# Altium project ESP32_Gateway.PrjPcb
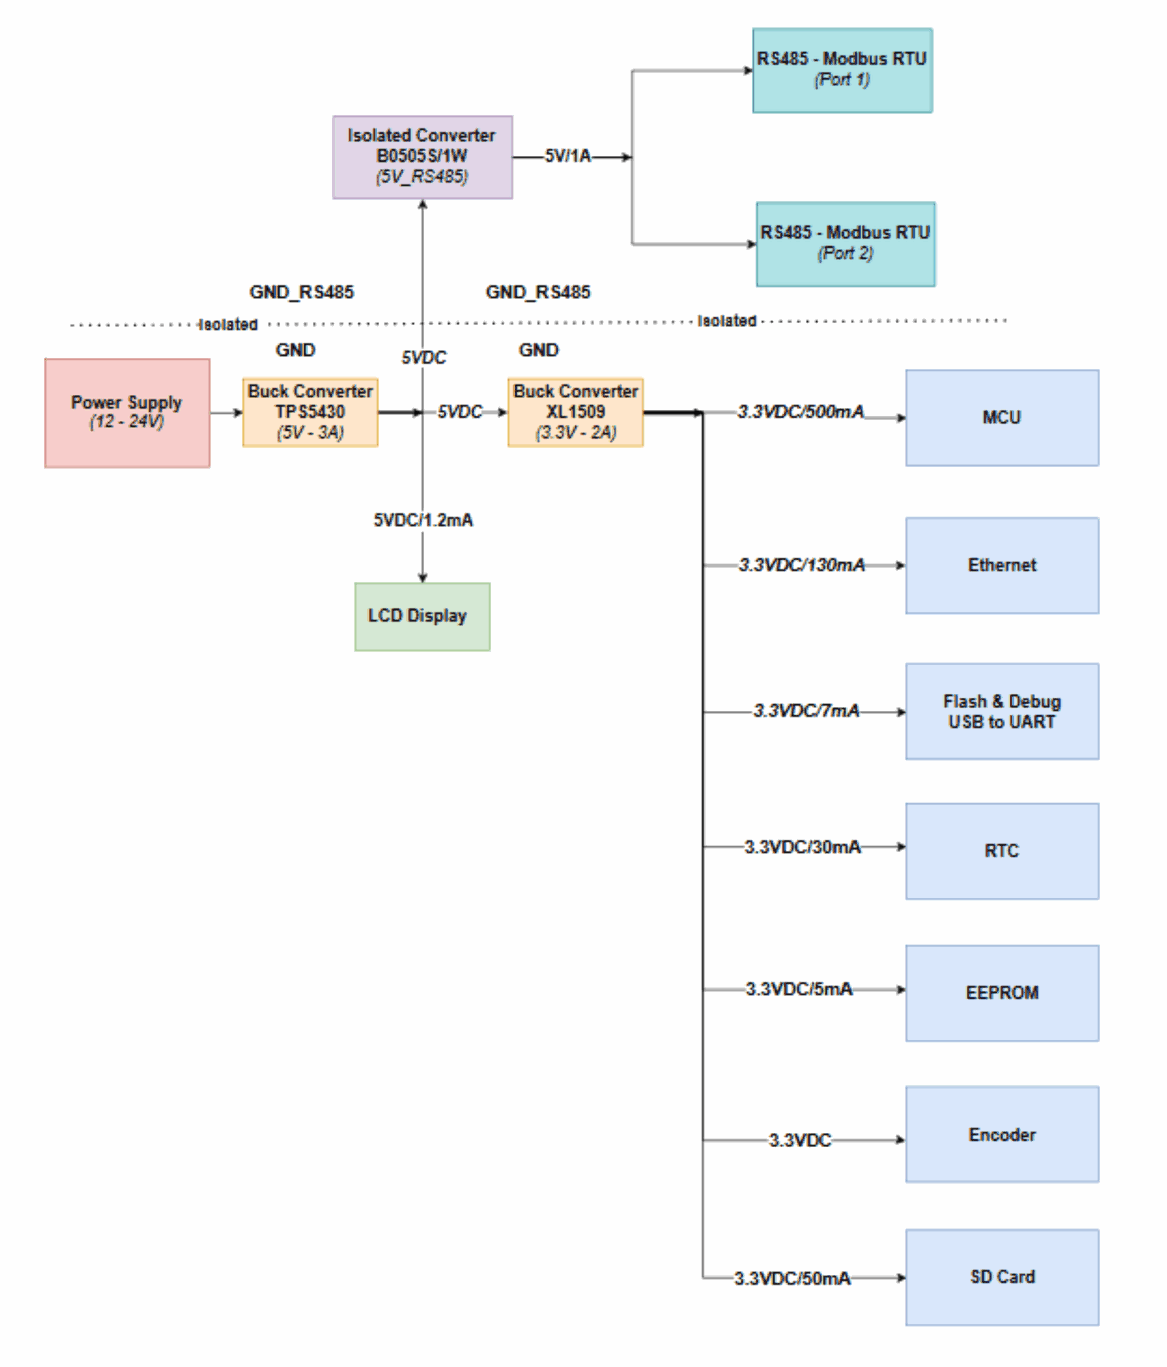
[diagram p0: Power_Tree.SchDoc]
7 sheets, 207 parts. Net scope: flat (ports and power ports of the same name join across sheets).
Board file: GATEWAY_PCB.PcbDoc
Sheets:
  Power_Tree.SchDoc
  Power_Supply.SchDoc
  Ethernet.SchDoc
  RS485_Port.SchDoc
  User_Interface.SchDoc
  RTC_and_EEPROM.SchDoc
  MCU.SchDoc

## Sheet Power_Tree.SchDoc
size A3; SheetNumber: 3; SheetTotal: 9

## Sheet Power_Supply.SchDoc
size A3; SheetNumber: 4; SheetTotal: 9
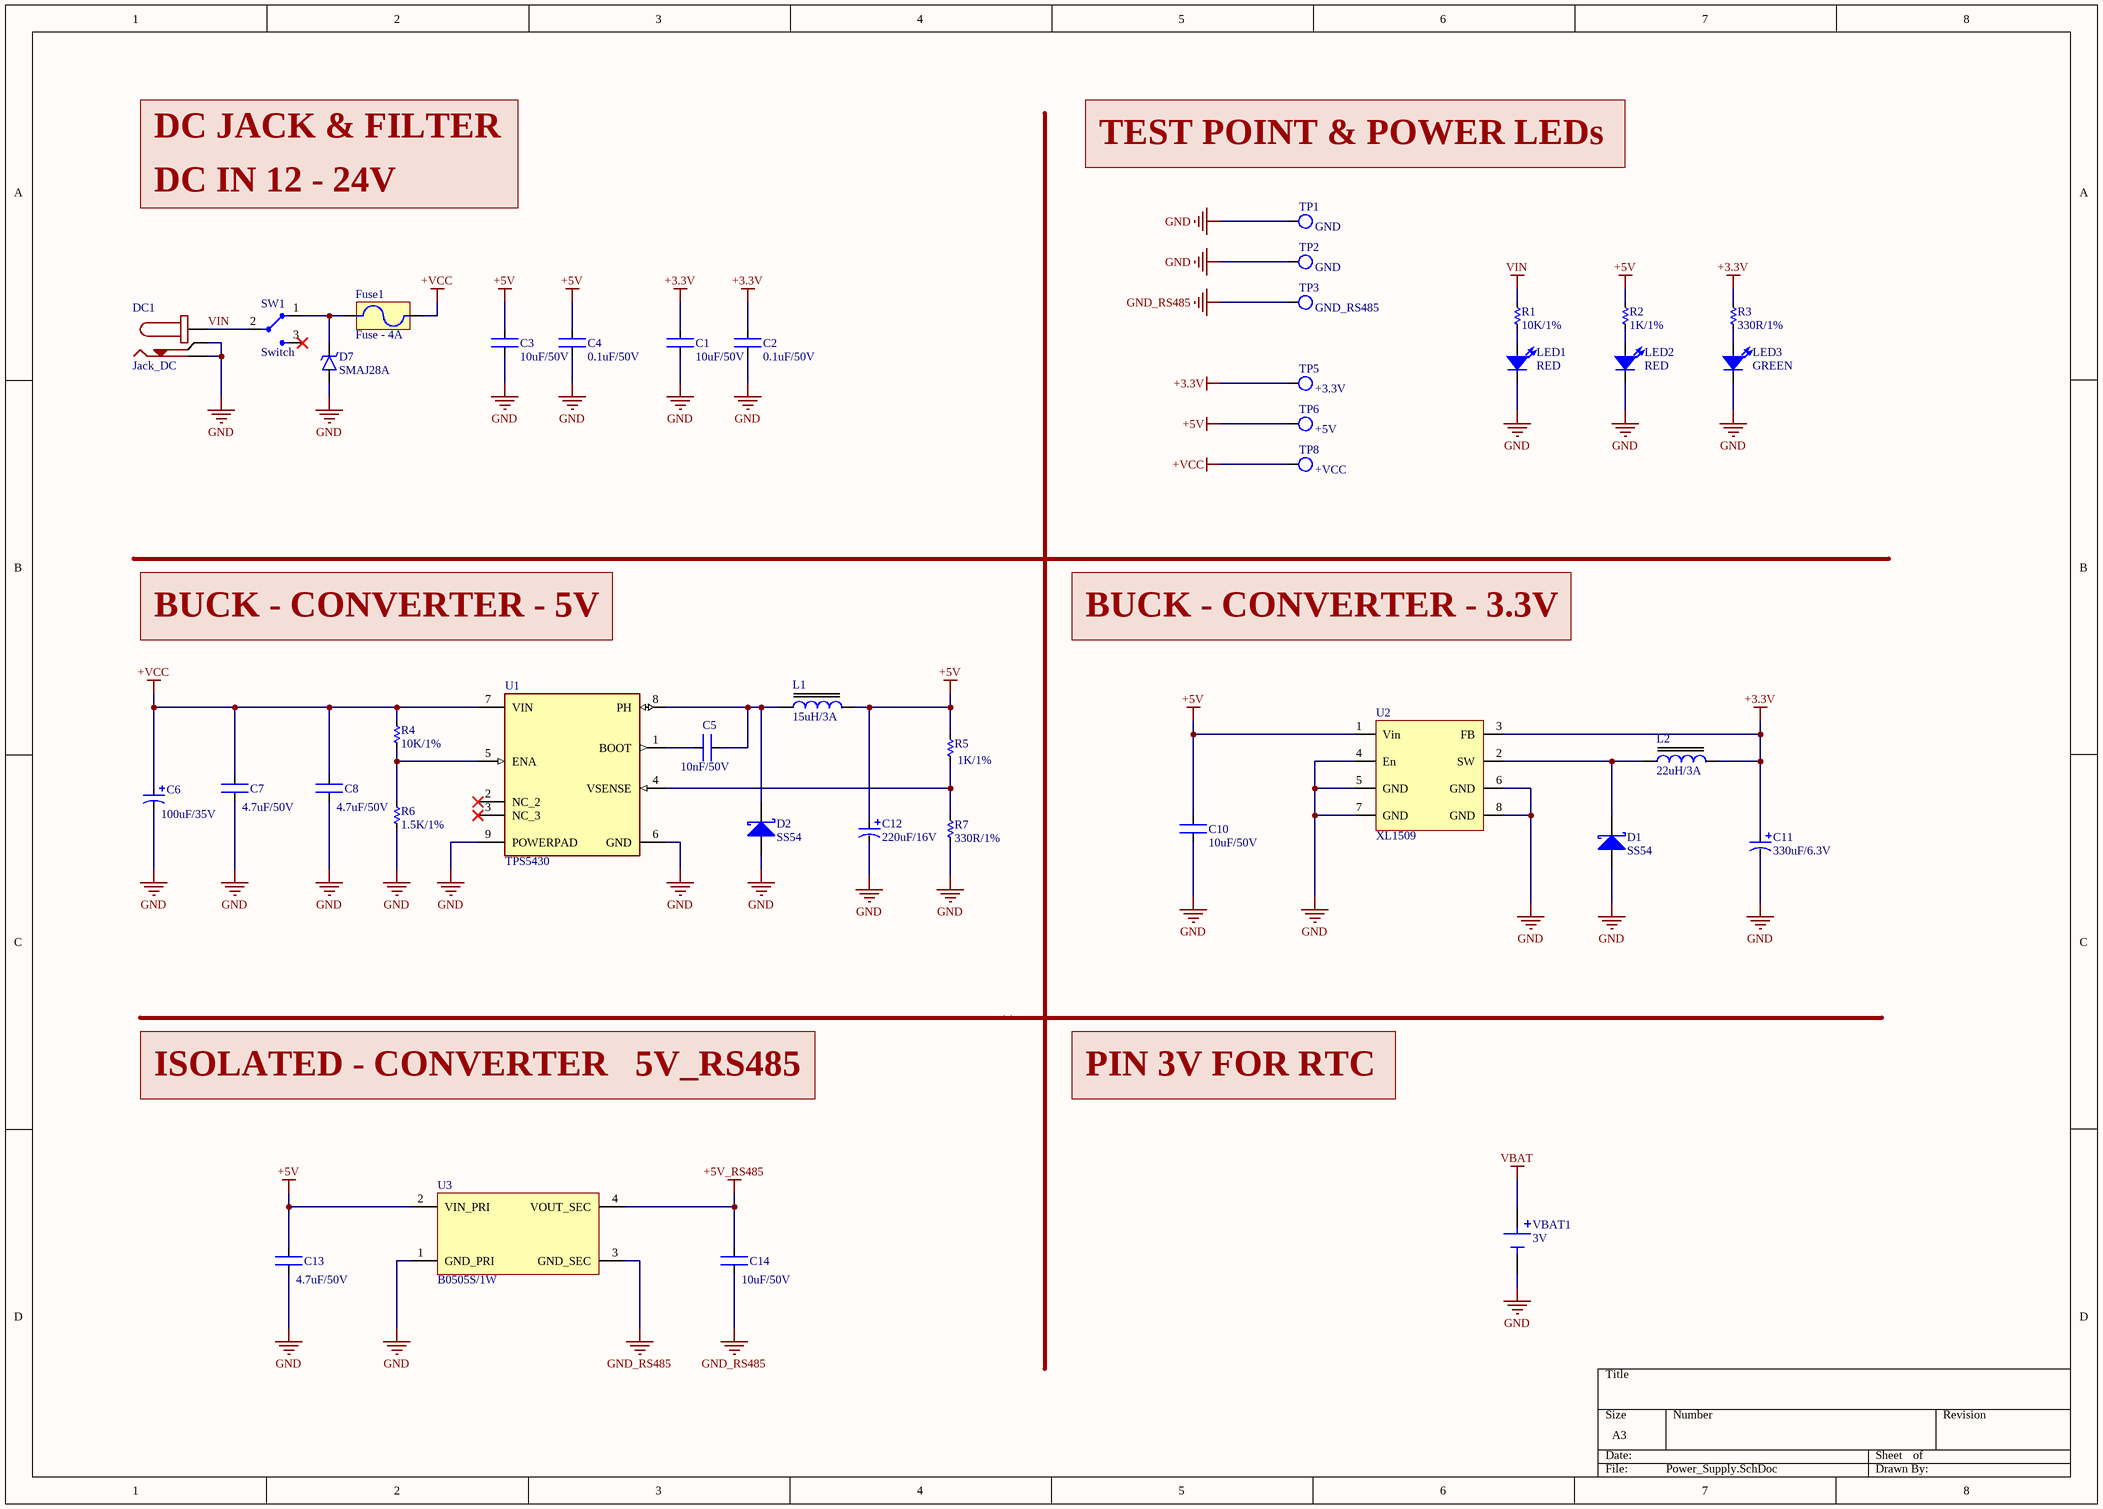
[diagram p1: Power_Supply.SchDoc]

### Parts
C1  10uF/50V  [CAP - 0603]
C2  0.1uF/50V  [CAP - 0603]
C3  10uF/50V  [CAP - 0603]
C4  0.1uF/50V  [CAP - 0603]
C5  10nF/50V  [CAP - 0603]
C6  100uF/35V  [Alu_Cap_6.3_7.7]
C7  4.7uF/50V  [CAP - 0603]
C8  4.7uF/50V  [CAP - 0603]
C10  10uF/50V  [CAP - 0603]
C11  330uF/6.3V  [Alu_Cap_6.3_7.7]
C12  220uF/16V  [Alu_Cap_6.3_7.7]
C13  4.7uF/50V  [CAP - 0603]
C14  10uF/50V  [CAP - 0603]
D1  SS54  [SS54]
D2  SS54  [SS54]
D7  SMAJ28A  [DO-214AC]
DC1  Jack_DC  [DC_5.5 x 2.1mm]
Fuse1  Fuse - 4A  [SMD-2]
L1  15uH/3A  [L_SMD_0630]
L2  22uH/3A  [L_SMD_0630]
LED1  RED  [RED_LED_0603]
LED2  RED  [RED_LED_0603]
LED3  GREEN  [GREEN_LED_0603]
R1  10K/1%  [RES - 0603]
R2  1K/1%  [RES - 0603]
R3  330R/1%  [RES - 0603]
R4  10K/1%  [RES - 0603]
R5  1K/1%  [RES - 0603]
R6  1.5K/1%  [RES - 0603]
R7  330R/1%  [RES - 0603]
SW1  Switch  [Dip_Switch_3_pins_0]
TP1  GND  [Test Point]
TP2  GND  [Test Point]
TP3  GND_RS485  [Test Point]
TP5  +3.3V  [Test Point]
TP6  +5V  [Test Point]
TP8  +VCC  [Test Point]
U1  TPS5430  [TPS5430]
U2  XL1509  [SOP_8]
U3  B0505S/1W  [B0505S/1W]
VBAT1  3V  [CR2032 - SMD]

### Nets
+3.3V: C1.1 C2.1 C11.1 L2.2 R3.1 TP5.1 U2.3(FB)
+5V: C3.1 C4.1 C10.1 C12.1 C13.1 L1.2 R2.1 R5.1 TP6.1 U2.1(Vin) U3.2(VIN_PRI)
+5V_RS485: C14.1 U3.4(VOUT_SEC)
+VCC: C6.1 C7.1 C8.1 Fuse1.2 R4.1 TP8.1 U1.7(VIN)
GND: C1.2 C2.2 C3.2 C4.2 C6.2 C7.2 C8.2 C10.2 C11.2 C12.2 C13.2 D1.1(A) D2.1(A) D7.A DC1.2(TN) DC1.3(T) LED1.2 LED2.2 LED3.2 R6.2 R7.2 TP1.1 TP2.1 U1.6(GND) U1.9(POWERPAD) U2.4(En) U2.5(GND) U2.6(GND) U2.7(GND) U2.8(GND) U3.1(GND_PRI) VBAT1.N(NEG)
GND_RS485: C14.2 TP3.1 U3.3(GND_SEC)
VBAT: VBAT1.P(POS)
VIN: DC1.1(S) R1.1 SW1.2
NetC5_1: C5.1 U1.1(BOOT)
NetC5_2: C5.2 D2.2(K) L1.1 U1.8(PH)
NetD1_2: D1.2(K) L2.1 U2.2(SW)
NetD7_C: D7.C Fuse1.1 SW1.1
NetLED1_1: LED1.1 R1.2
NetLED2_1: LED2.1 R2.2
NetLED3_1: LED3.1 R3.2
NetR4_2: R4.2 R6.1 U1.5(ENA)
NetR5_2: R5.2 R7.1 U1.4(VSENSE)

Not connected (* = marked no-connect by the designer): SW1 3(I/O2)*; U1 2(NC_2)* 3(NC_3)*

### Notes on the sheet
- DC JACK & FILTER
- TEST POINT & POWER LEDs
- DC IN 12 - 24V
- BUCK - CONVERTER - 5V
- BUCK - CONVERTER - 3.3V
- ISOLATED - CONVERTER   5V_RS485
- PIN 3V FOR RTC

### Library data of the parts
C1-C5 C7 C8 C10 C13 C14 = CAPACITOR: CAPACITOR SMD - KEMET
C6 C11 C12 = Alu_Capacitor
D1 D2 = SS54: DIODE SCHOTTKY 40V 5A SMA; Supplier 1: Newark; Supplier Part Number 1: 08X3002
D7 = SMAJ28A: 45.4V Clamp 8.8A Ipp Tvs diode surface mount
DC1 = Jack_DC: Jack DC IN (Hole)
Fuse1 = Fuse: Nano2 SMD FF submin fuse w/holder, 4A | Littelfuse 0154004.DR
L1 L2 = Inductor_1_SMD
LED1-LED3 = LED_SMD: LED SMD
R1-R7 = RESISTOR: Resistor SMD - YAGEO
SW1 = Switch: Switch 3 Pins
TP1-TP3 TP5 TP6 TP8 = TEST POINT: Supplier Part Number 1: 36-5014-ND; Supplier 1: Digikey
U1 = TPS5430: Buck DC to DC Converter
U2 = XL1509: Buck Converter
U3 = B0505S/1W: Isolated - Converter
VBAT1 = Battery Base: Battery Base CR2032

## Sheet Ethernet.SchDoc
size A3; SheetNumber: 5; SheetTotal: 9
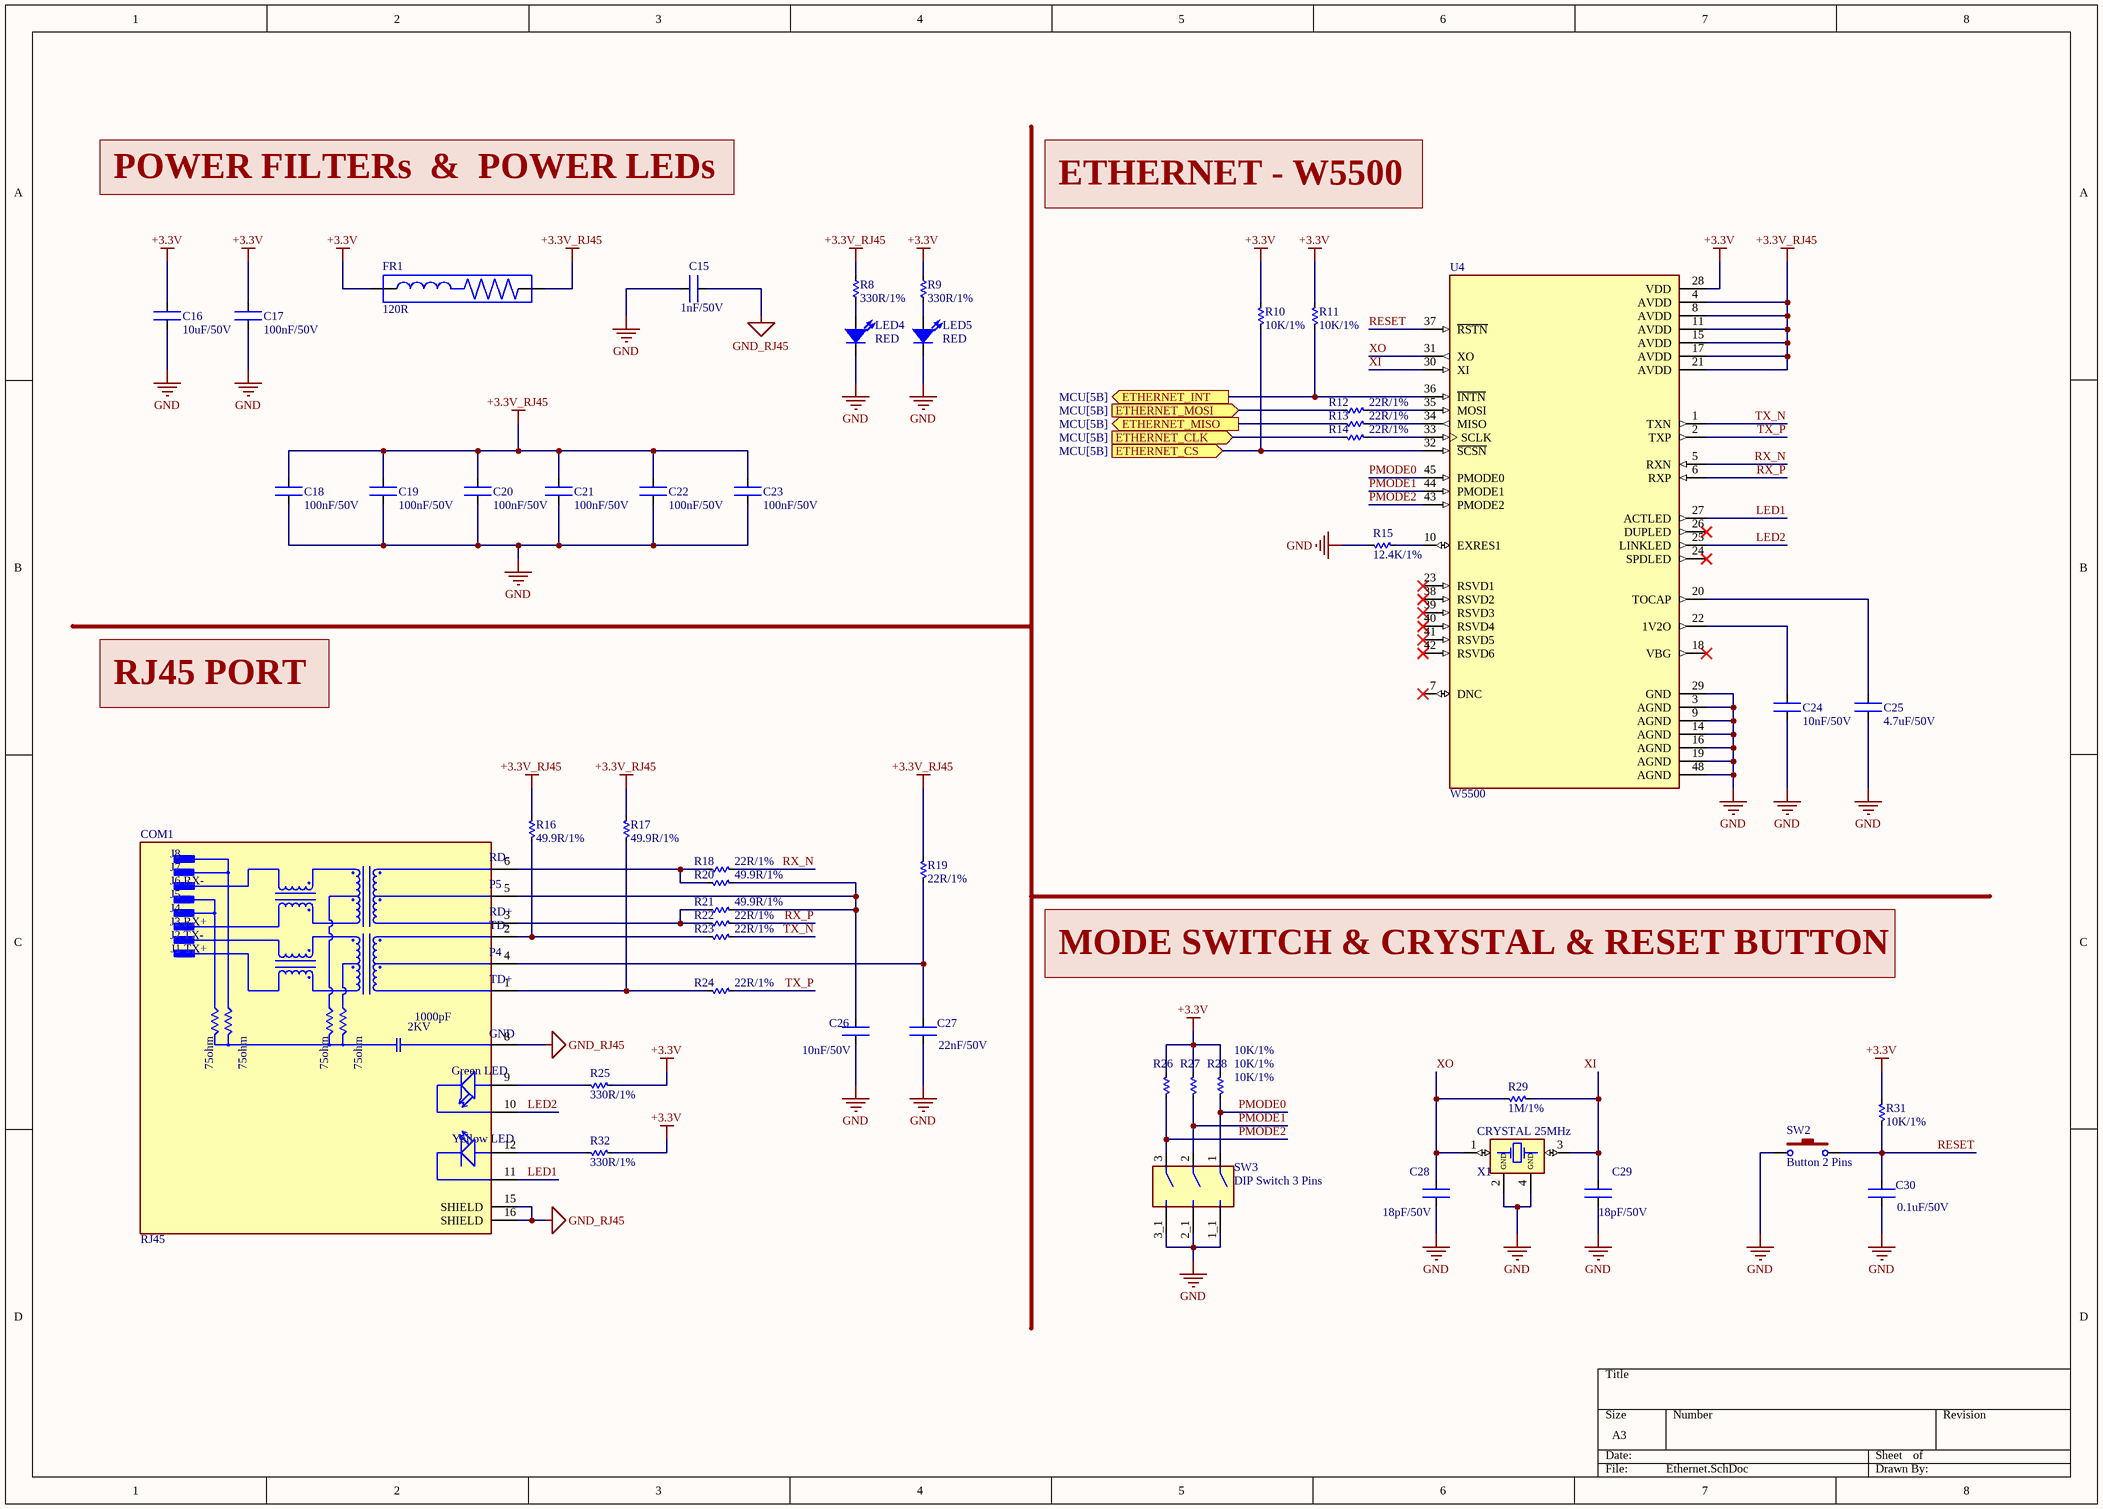
[diagram p2: Ethernet.SchDoc]

### Parts
C15  1nF/50V  [CAP - 0603]
C16  10uF/50V  [CAP - 0603]
C17  100nF/50V  [CAP - 0603]
C18  100nF/50V  [CAP - 0603]
C19  100nF/50V  [CAP - 0603]
C20  100nF/50V  [CAP - 0603]
C21  100nF/50V  [CAP - 0603]
C22  100nF/50V  [CAP - 0603]
C23  100nF/50V  [CAP - 0603]
C24  10nF/50V  [CAP - 0603]
C25  4.7uF/50V  [CAP - 0603]
C26  10nF/50V  [CAP - 0603]
C27  22nF/50V  [CAP - 0603]
C28  18pF/50V  [CAP - 0603]
C29  18pF/50V  [CAP - 0603]
C30  0.1uF/50V  [CAP - 0603]
COM1  RJ45  [RJ45]
FR1  120R  [FR-0805]
LED4  RED  [RED_LED_0603]
LED5  RED  [RED_LED_0603]
R8  330R/1%  [RES - 0603]
R9  330R/1%  [RES - 0603]
R10  10K/1%  [RES - 0603]
R11  10K/1%  [RES - 0603]
R12  22R/1%  [RES - 0603]
R13  22R/1%  [RES - 0603]
R14  22R/1%  [RES - 0603]
R15  12.4K/1%  [RES - 0603]
R16  49.9R/1%  [RES - 0603]
R17  49.9R/1%  [RES - 0603]
R18  22R/1%  [RES - 0603]
R19  22R/1%  [RES - 0603]
R20  49.9R/1%  [RES - 0603]
R21  49.9R/1%  [RES - 0603]
R22  22R/1%  [RES - 0603]
R23  22R/1%  [RES - 0603]
R24  22R/1%  [RES - 0603]
R25  330R/1%  [RES - 0603]
R26  10K/1%  [RES - 0603]
R27  10K/1%  [RES - 0603]
R28  10K/1%  [RES - 0603]
R29  1M/1%  [RES - 0603]
R31  10K/1%  [RES - 0603]
R32  330R/1%  [RES - 0603]
SW2  Button 2 Pins  [SMD SWITCH 2 PINS]
SW3  DIP Switch 3 Pins  [SMD - SW - 3Pins]
U4  W5500  [LQFP-48]
X1  CRYSTAL 25MHz  [crystal - 3.2 x 2.5 mm]

### Ports
ETHERNET_CLK (in, see MCU[5B]), ETHERNET_CS (in, see MCU[5B]), ETHERNET_INT (out, see MCU[5B]), ETHERNET_MISO (out, see MCU[5B]), ETHERNET_MOSI (in, see MCU[5B])

### Nets
+3.3V: C16.2 C17.2 FR1.1 R9.1 R10.2 R11.2 R25.1 R26.2 R27.2 R28.2 R31.1 R32.1 U4.28(VDD)
+3.3V_RJ45: C18.2 C19.2 C20.2 C21.2 C22.2 C23.2 FR1.2 R8.1 R16.2 R17.2 R19.1 U4.4(AVDD) U4.8(AVDD) U4.11(AVDD) U4.15(AVDD) U4.17(AVDD) U4.21(AVDD)
GND: C15.1 C16.1 C17.1 C18.1 C19.1 C20.1 C21.1 C22.1 C23.1 C24.1 C25.1 C26.1 C27.1 C28.1 C29.1 C30.1 LED4.2 LED5.2 R15.1 SW2.1 SW3.1_1 SW3.2_1 SW3.3_1 U4.3(AGND) U4.9(AGND) U4.14(AGND) U4.16(AGND) U4.19(AGND) U4.29(GND) U4.48(AGND) X1.2(GND) X1.4(GND)
GND_RJ45: C15.2 COM1.8(GND) COM1.15(SHIELD) COM1.16(SHIELD)
ETH_CLK: R14.2 ; port ETHERNET_CLK
ETH_CS: R10.1 U4.32(~{SCSN}) ; port ETHERNET_CS
ETH_INT: R11.1 U4.36(~{INTN}) ; port ETHERNET_INT
ETH_MISO: R13.2 ; port ETHERNET_MISO
ETH_MOSI: R12.2 ; port ETHERNET_MOSI
LED1: COM1.11(YC) U4.27(ACTLED)
LED2: COM1.10(GC) U4.25(LINKLED)
PMODE0: R28.1 SW3.1 U4.45(PMODE0)
PMODE1: R27.1 SW3.2 U4.44(PMODE1)
PMODE2: R26.1 SW3.3 U4.43(PMODE2)
RESET: C30.2 R31.2 SW2.2 U4.37(~{RSTN})
RX_N: R18.1 U4.5(RXN)
RX_P: R22.1 U4.6(RXP)
TX_N: R23.1 U4.1(TXN)
TX_P: R24.1 U4.2(TXP)
XI: C29.2 R29.1 U4.30(XI) X1.3(OUT/IN)
XO: C28.2 R29.2 U4.31(XO) X1.1(IN/OUT)
NetC24_2: C24.2 U4.22(1V2O)
NetC25_2: C25.2 U4.20(TOCAP)
NetC26_2: C26.2 COM1.5(P5) R20.1 R21.1
NetC27_2: C27.2 COM1.4(P4) R19.2
NetCOM1_1: COM1.1(TD+) R17.1 R24.2
NetCOM1_2: COM1.2(TD-) R16.1 R23.2
NetCOM1_3: COM1.3(RD+) R21.2 R22.2
NetCOM1_6: COM1.6(RD-) R18.2 R20.2
NetCOM1_9: COM1.9(GA) R25.2
NetCOM1_12: COM1.12(YA) R32.2
NetLED4_1: LED4.1 R8.2
NetLED5_1: LED5.1 R9.2
NetR12_1: R12.1 U4.35(MOSI)
NetR13_1: R13.1 U4.34(MISO)
NetR14_1: R14.1 U4.33(SCLK)
NetR15_2: R15.2 U4.10(EXRES1)

Not connected (* = marked no-connect by the designer): U4 7(DNC)* 18(VBG)* 23(RSVD1)* 24(SPDLED)* 26(DUPLED)* 38(RSVD2)* 39(RSVD3)* 40(RSVD4)* 41(RSVD5)* 42(RSVD6)*

### Notes on the sheet
- POWER FILTERs  &  POWER LEDs
- ETHERNET - W5500
- RJ45 PORT
- MODE SWITCH & CRYSTAL & RESET BUTTON
- (in symbol RJ45) J8; J7; J6 RX-; J5; J4; J3 RX+; J2 TX-; J1 TX+; 1000pF; 75ohm; 2KV; Green LED; Yellow LED

### Library data of the parts
C15-C30 = CAPACITOR: CAPACITOR SMD - KEMET
COM1 = RJ45: HR911105A
FR1 = Ferrite Beads: SMD
LED4 LED5 = LED_SMD: LED SMD
R8-R29 R31 R32 = RESISTOR: Resistor SMD - YAGEO
SW2 = Button 2 Pins: SMD Button; Supplier 1: Newark; Supplier Part Number 1: 35AH5160
SW3 = DIP Switch 3 Pins: Switch DIP ON OFF SPST 3 Flush Slide 0.1A 20VDC Gull Wing 2000Cycles 2.54mm SMD T/R
U4 = W5500: Hardwired TCP/IP embedded Ethernet controller
X1 = CRYSTAL 8MHz: SMD CRYSTAL; Supplier 1: Avnet; Supplier Part Number 1: ECS-80-8-33Q-ADS

## Sheet RS485_Port.SchDoc
size A3; SheetNumber: 6; SheetTotal: 9
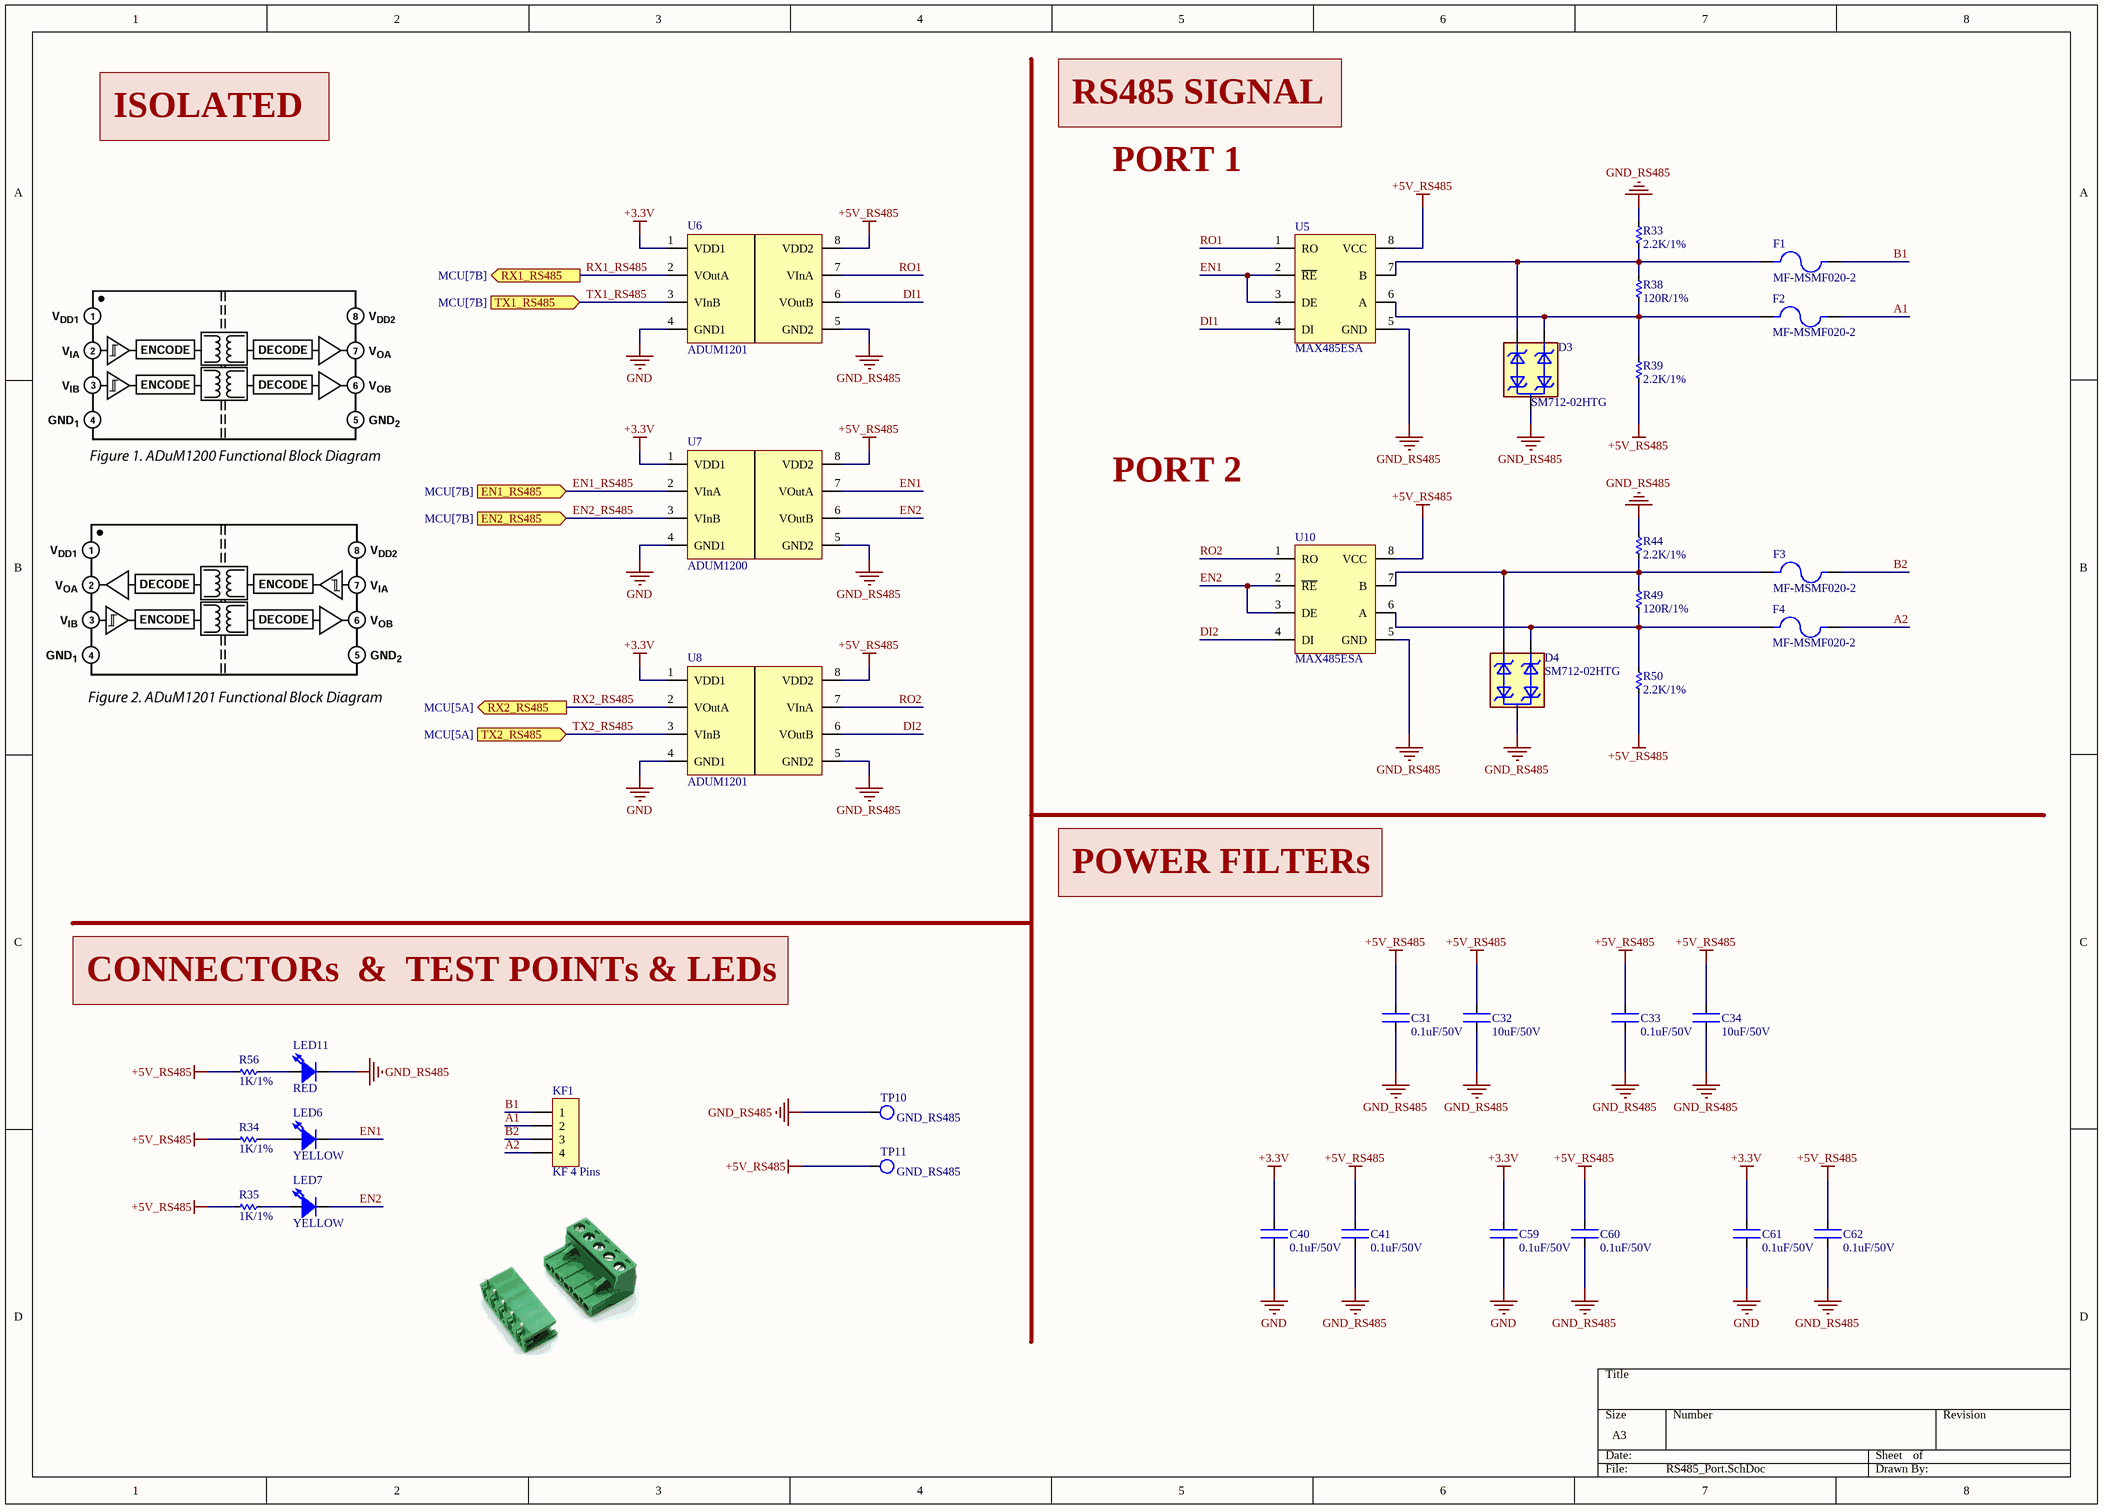
[diagram p3: RS485_Port.SchDoc]

### Parts
C31  0.1uF/50V  [CAP - 0603]
C32  10uF/50V  [CAP - 0603]
C33  0.1uF/50V  [CAP - 0603]
C34  10uF/50V  [CAP - 0603]
C40  0.1uF/50V  [CAP - 0603]
C41  0.1uF/50V  [CAP - 0603]
C59  0.1uF/50V  [CAP - 0603]
C60  0.1uF/50V  [CAP - 0603]
C61  0.1uF/50V  [CAP - 0603]
C62  0.1uF/50V  [CAP - 0603]
D3  SM712-02HTG  [SOT23-3]
D4  SM712-02HTG  [SOT23-3]
F1  MF-MSMF020-2  [Fuse 4.55x3.24 mm]
F2  MF-MSMF020-2  [Fuse 4.55x3.24 mm]
F3  MF-MSMF020-2  [Fuse 4.55x3.24 mm]
F4  MF-MSMF020-2  [Fuse 4.55x3.24 mm]
KF1  KF 4 Pins  [KF_4]
LED6  YELLOW  [YELLOW_LED_0805]
LED7  YELLOW  [YELLOW_LED_0805]
LED11  RED  [RED_LED_0603]
R33  2.2K/1%  [RES - 0603]
R34  1K/1%  [RES - 0603]
R35  1K/1%  [RES - 0603]
R38  120R/1%  [RES - 0603]
R39  2.2K/1%  [RES - 0603]
R44  2.2K/1%  [RES - 0603]
R49  120R/1%  [RES - 0603]
R50  2.2K/1%  [RES - 0603]
R56  1K/1%  [RES - 0603]
TP10  GND_RS485  [Test Point]
TP11  GND_RS485  [Test Point]
U5  MAX485ESA  [SOP_8]
U6  ADUM1201  [SOP_8]
U7  ADUM1200  [SOP_8]
U8  ADUM1201  [SOP_8]
U10  MAX485ESA  [SOP_8]

### Ports
EN1_RS485 (in, see MCU[7B]), EN2_RS485 (in, see MCU[7B]), RX1_RS485 (out, see MCU[7B]), RX2_RS485 (out, see MCU[5A]), TX1_RS485 (in, see MCU[7B]), TX2_RS485 (in, see MCU[5A])

### Nets
+3.3V: C40.1 C59.1 C61.1 U6.1(VDD1) U7.1(VDD1) U8.1(VDD1)
+5V_RS485: C31.1 C32.1 C33.1 C34.1 C41.1 C60.1 C62.1 R34.1 R35.1 R39.1 R50.1 R56.1 TP11.1 U5.8(VCC) U6.8(VDD2) U7.8(VDD2) U8.8(VDD2) U10.8(VCC)
GND: C40.2 C59.2 C61.2 U6.4(GND1) U7.4(GND1) U8.4(GND1)
GND_RS485: C31.2 C32.2 C33.2 C34.2 C41.2 C60.2 C62.2 D3.3 D4.3 LED11.2 R33.2 R44.2 TP10.1 U5.5(GND) U6.5(GND2) U7.5(GND2) U8.5(GND2) U10.5(GND)
A1: F2.2 KF1.2
A2: F4.2 KF1.4
B1: F1.2 KF1.1
B2: F3.2 KF1.3
DI1: U5.4(DI) U6.6(VOutB)
DI2: U8.6(VOutB) U10.4(DI)
EN1: LED6.2 U5.2(~{RE}) U5.3(DE) U7.7(VOutA)
EN1_RS485: U7.2(VInA) ; port EN1_RS485
EN2: LED7.2 U7.6(VOutB) U10.2(~{RE}) U10.3(DE)
EN2_RS485: U7.3(VInB) ; port EN2_RS485
RO1: U5.1(RO) U6.7(VInA)
RO2: U8.7(VInA) U10.1(RO)
RX1_RS485: U6.2(VOutA) ; port RX1_RS485
RX2_RS485: U8.2(VOutA) ; port RX2_RS485
TX1_RS485: U6.3(VInB) ; port TX1_RS485
TX2_RS485: U8.3(VInB) ; port TX2_RS485
NetD3_1: D3.1 F2.1 R38.1 R39.2 U5.6(A)
NetD3_2: D3.2 F1.1 R33.1 R38.2 U5.7(B)
NetD4_1: D4.1 F4.1 R49.1 R50.2 U10.6(A)
NetD4_2: D4.2 F3.1 R44.1 R49.2 U10.7(B)
NetLED6_1: LED6.1 R34.2
NetLED7_1: LED7.1 R35.2
NetLED11_1: LED11.1 R56.2

### Notes on the sheet
- RS485 SIGNAL
- ISOLATED
- PORT 1
- PORT 2
- POWER FILTERs
- CONNECTORs  &  TEST POINTs & LEDs

### Library data of the parts
C31-C34 C40 C41 C59-C62 = CAPACITOR: CAPACITOR SMD - KEMET
D3 D4 = SM712-02HTG: TVS Diode, SM712 Series, 31V Clamp, 600W Peak Pulse, Surface Mount, SOT23-3 | Littelfuse SM712-02HTG
F1-F4 = MF-MSMF020-2: Fuse Resettable 30V/0.2A; Size 4.55 x 3.24mm
KF1 = KF 4 Pins: KF Terminal Block Plug-in
LED6 LED7 LED11 = LED_SMD: LED SMD
R33-R35 R38 R39 R44 R49 R50 R56 = RESISTOR: Resistor SMD - YAGEO
TP10 TP11 = TEST POINT: Supplier Part Number 1: 36-5014-ND; Supplier 1: Digikey
U5 U10 = MAX485ESA: 1/1 Transceiver Half RS422, RS485
U6 U8 = ADUM1201: Dual-Channel Digital Isolators, General Purpose Digital Isolator 2500Vrms 2 Channel 1Mbps 25kV/µs
U7 = ADUM1200: Dual-Channel Digital Isolators, General Purpose Digital Isolator 2500Vrms 2 Channel 1Mbps 25kV/µs

## Sheet User_Interface.SchDoc
size A3; SheetNumber: 7; SheetTotal: 9
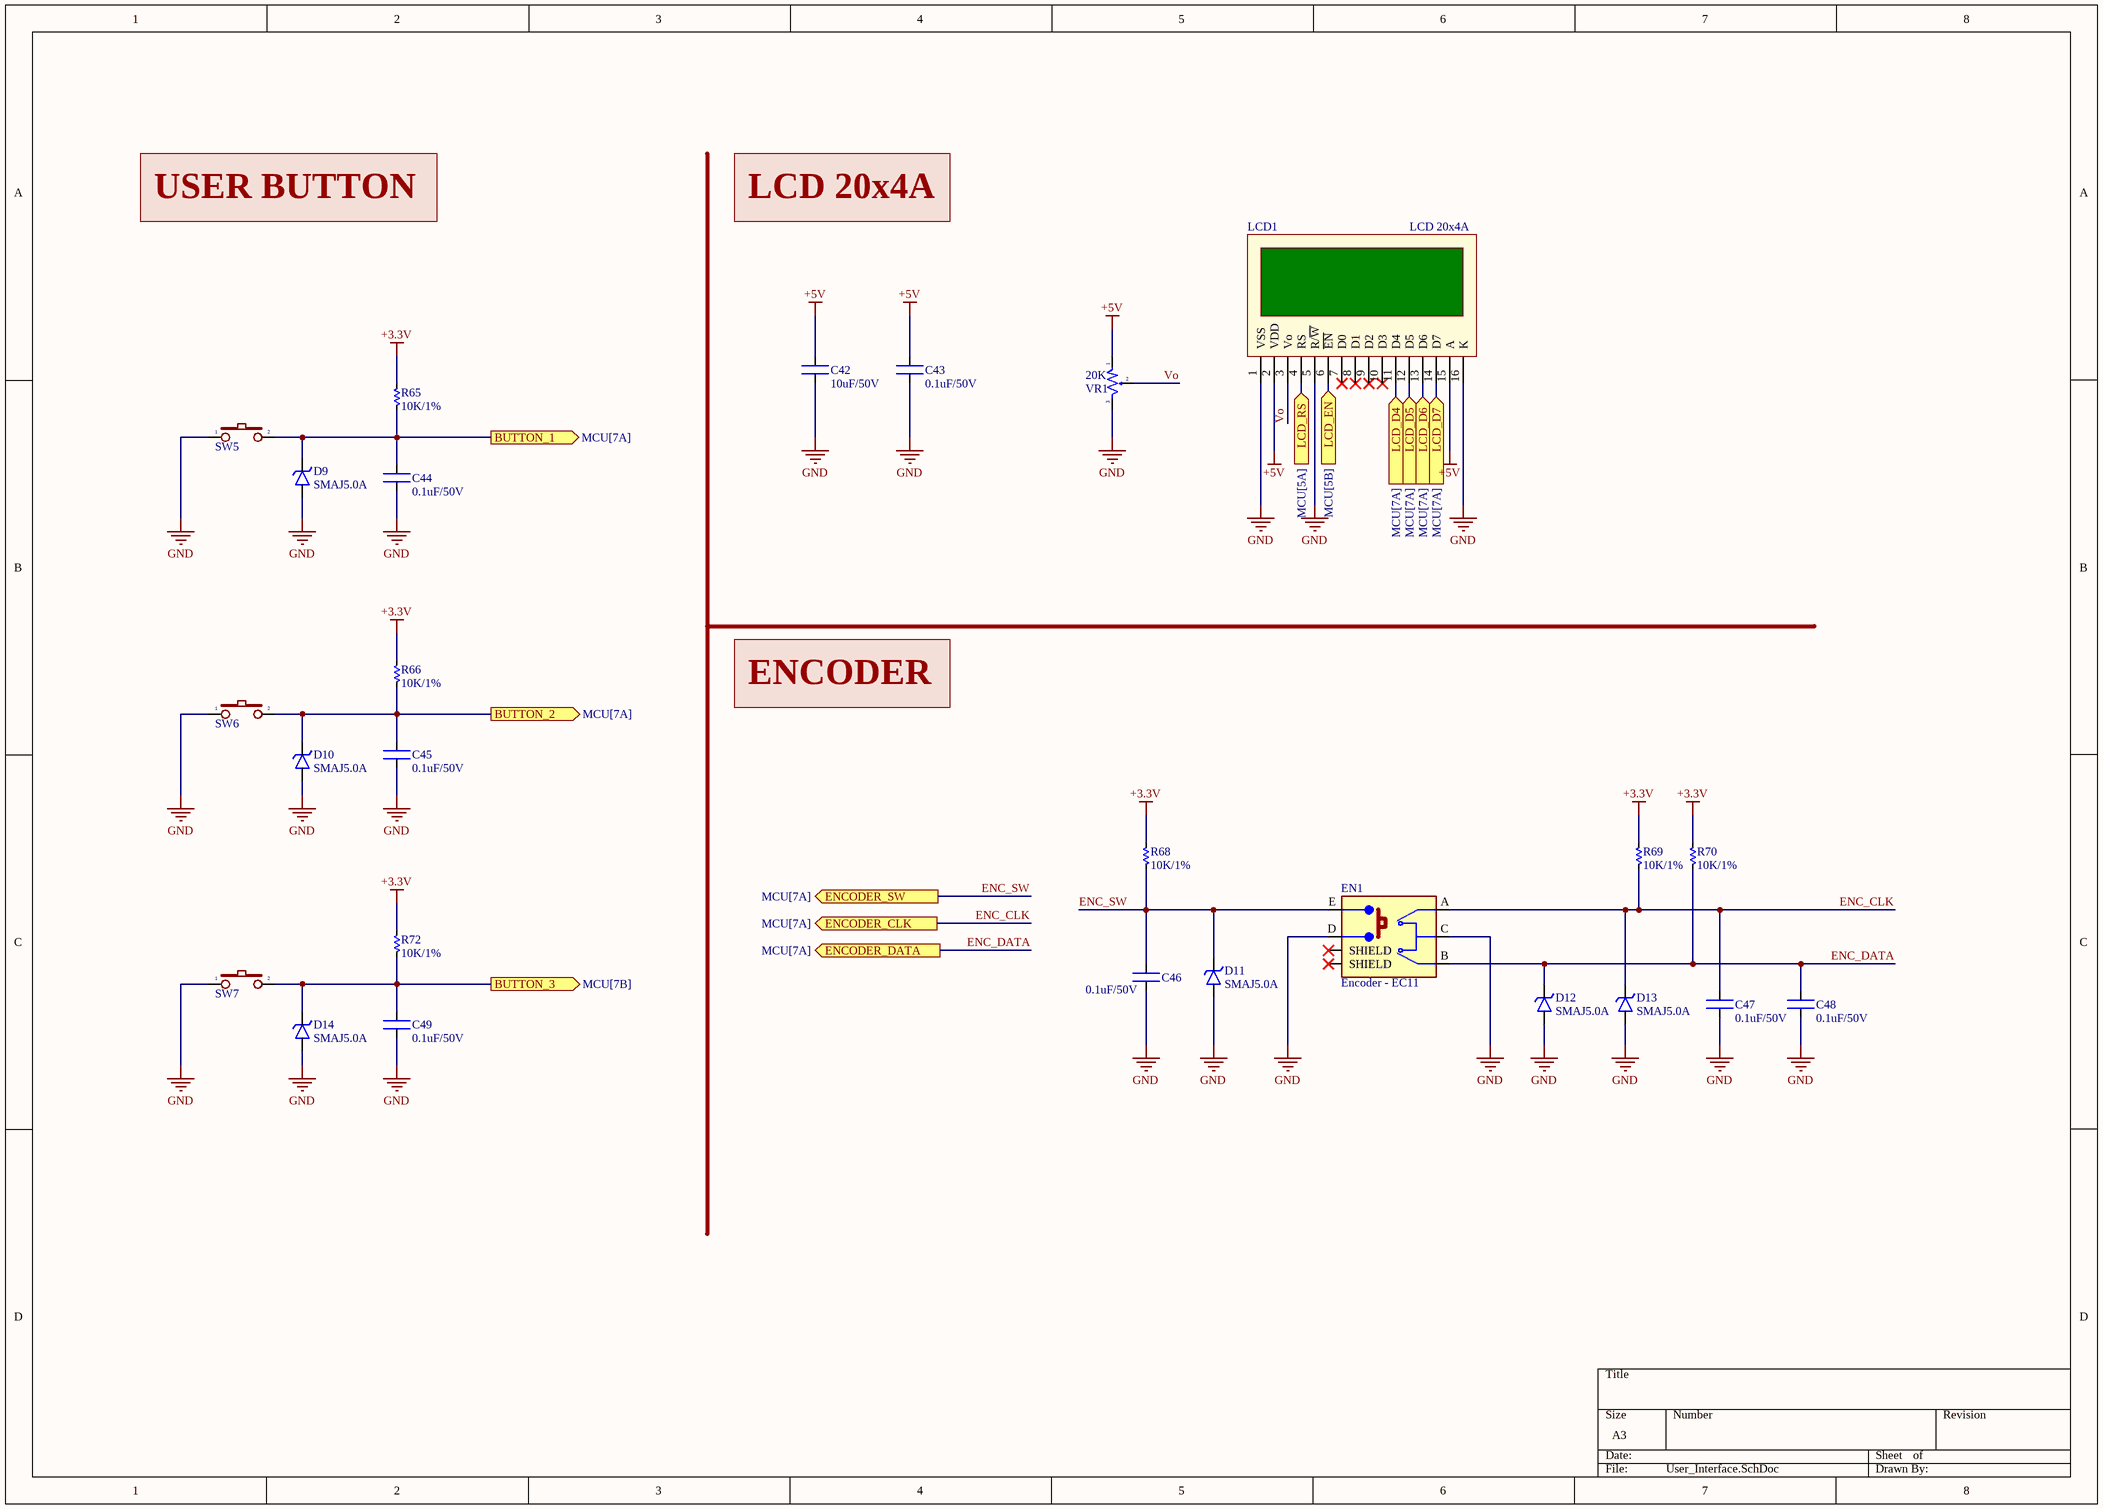
[diagram p4: User_Interface.SchDoc]

### Parts
C42  10uF/50V  [CAP - 0603]
C43  0.1uF/50V  [CAP - 0603]
C44  0.1uF/50V  [CAP - 0603]
C45  0.1uF/50V  [CAP - 0603]
C46  0.1uF/50V  [CAP - 0603]
C47  0.1uF/50V  [CAP - 0603]
C48  0.1uF/50V  [CAP - 0603]
C49  0.1uF/50V  [CAP - 0603]
D9  SMAJ5.0A  [DO-214AC]
D10  SMAJ5.0A  [DO-214AC]
D11  SMAJ5.0A  [DO-214AC]
D12  SMAJ5.0A  [DO-214AC]
D13  SMAJ5.0A  [DO-214AC]
D14  SMAJ5.0A  [DO-214AC]
EN1  Encoder - EC11  [Encoder - EC11]
LCD1  LCD 20x4A  [LCD-20x4A-4-Holes]
R65  10K/1%  [RES - 0603]
R66  10K/1%  [RES - 0603]
R68  10K/1%  [RES - 0603]
R69  10K/1%  [RES - 0603]
R70  10K/1%  [RES - 0603]
R72  10K/1%  [RES - 0603]
SW5  Button 4 Pins  [SW-SMD-6x6mm]  (value not drawn)
SW6  Button 4 Pins  [SW-SMD-6x6mm]  (value not drawn)
SW7  Button 4 Pins  [SW-SMD-6x6mm]  (value not drawn)
VR1  20K  [VR 3x3]

### Ports
BUTTON_1 (out, see MCU[7A]), BUTTON_2 (out, see MCU[7A]), BUTTON_3 (out, see MCU[7B]), ENCODER_CLK (out, see MCU[7A]), ENCODER_DATA (out, see MCU[7A]), ENCODER_SW (out, see MCU[7A]), LCD_D4 (in, see MCU[7A]), LCD_D5 (in, see MCU[7A]), LCD_D6 (in, see MCU[7A]), LCD_D7 (in, see MCU[7A]), LCD_EN (in, see MCU[5B]), LCD_RS (in, see MCU[5A])

### Nets
+3.3V: R65.2 R66.2 R68.2 R69.2 R70.2 R72.1
+5V: C42.2 C43.2 LCD1.2(VDD) LCD1.15(A) VR1.1
GND: C42.1 C43.1 C44.1 C45.1 C46.1 C47.1 C48.1 C49.1 D9.A D10.A D11.A D12.A D13.A D14.A EN1.C EN1.D(S1) LCD1.1(VSS) LCD1.5(R/~{W}) LCD1.16(K) SW5.1 SW6.1 SW7.1 VR1.3
ENC_CLK: C47.2 D13.C EN1.A R69.1 ; port ENCODER_CLK
ENC_DATA: C48.2 D12.C EN1.B R70.1 ; port ENCODER_DATA
ENC_SW: C46.2 D11.C EN1.E(S2) R68.1 ; port ENCODER_SW
LCD_D6: LCD1.13(D6) ; port LCD_D6
LCD_D7: LCD1.14(D7) ; port LCD_D7
LCD_EN: LCD1.6(~{EN}) ; port LCD_EN
Vo: LCD1.3(Vo) VR1.2
NetC44_2: C44.2 D9.C R65.1 SW5.2 ; port BUTTON_1
NetC45_2: C45.2 D10.C R66.1 SW6.2 ; port BUTTON_2
NetC49_2: C49.2 D14.C R72.2 SW7.2 ; port BUTTON_3
NetLCD1_4: LCD1.4(RS) ; port LCD_RS
NetLCD1_11: LCD1.11(D4) ; port LCD_D4
NetLCD1_12: LCD1.12(D5) ; port LCD_D5

Not connected (* = marked no-connect by the designer): EN1 SH1(SHIELD)* SH2(SHIELD)*; LCD1 7(D0)* 8(D1)* 9(D2)* 10(D3)*

### Notes on the sheet
- USER BUTTON
- LCD 20x4A
- ENCODER

### Library data of the parts
C42-C49 = CAPACITOR: CAPACITOR SMD - KEMET
D9-D14 = SMAJ5.0A: TVS, 400W, 5V, Unidirectional
EN1 = Encoder - EC11: Bourns PEC11R-4015F-S0024
LCD1 = LCD 20x4A: LCD 2004
R65 R66 R68-R70 R72 = RESISTOR: Resistor SMD - YAGEO
SW5-SW7 = Button 4 Pins: DIP Button 4 Pins
VR1 = VARIABLE RESISTOR: VR

## Sheet RTC_and_EEPROM.SchDoc
size A3; SheetNumber: 8; SheetTotal: 9
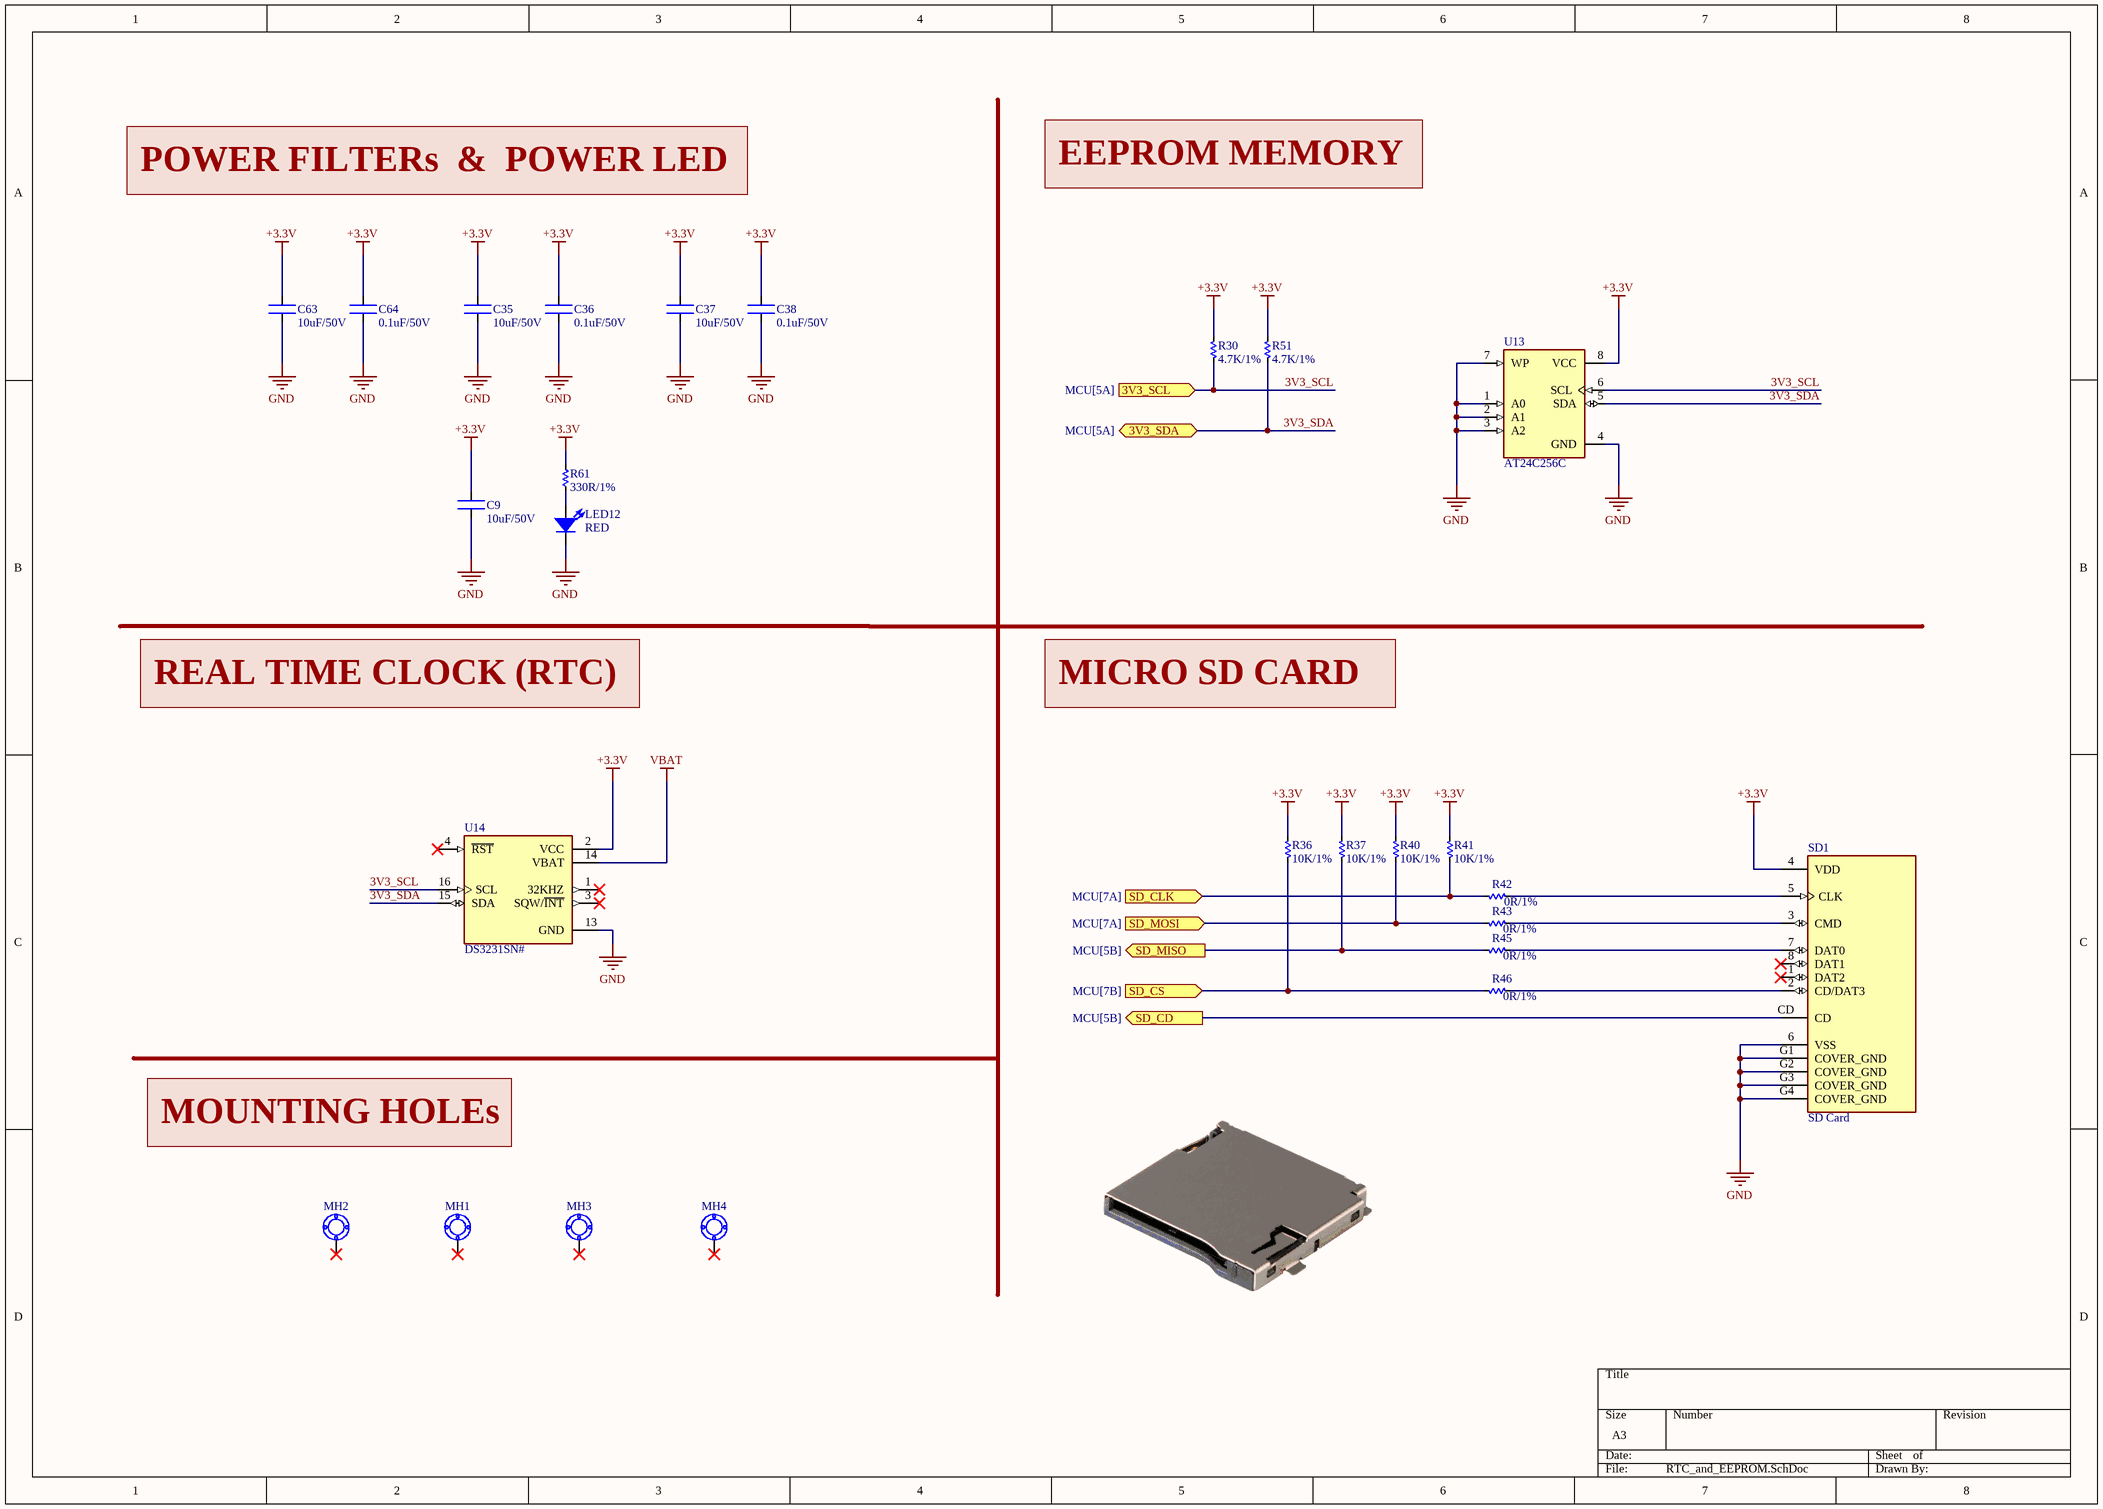
[diagram p5: RTC_and_EEPROM.SchDoc]

### Parts
C9  10uF/50V  [CAP - 0603]
C35  10uF/50V  [CAP - 0603]
C36  0.1uF/50V  [CAP - 0603]
C37  10uF/50V  [CAP - 0603]
C38  0.1uF/50V  [CAP - 0603]
C63  10uF/50V  [CAP - 0603]
C64  0.1uF/50V  [CAP - 0603]
LED12  RED  [RED_LED_0603]
MH1  MOUNTING HOLE  [Mounting hole_2]  (value not drawn)
MH2  MOUNTING HOLE  [Mounting hole_2]  (value not drawn)
MH3  MOUNTING HOLE  [Mounting hole_2]  (value not drawn)
MH4  MOUNTING HOLE  [Mounting hole_2]  (value not drawn)
R30  4.7K/1%  [RES - 0603]
R36  10K/1%  [RES - 0603]
R37  10K/1%  [RES - 0603]
R40  10K/1%  [RES - 0603]
R41  10K/1%  [RES - 0603]
R42  0R/1%  [RES - 0603]
R43  0R/1%  [RES - 0603]
R45  0R/1%  [RES - 0603]
R46  0R/1%  [RES - 0603]
R51  4.7K/1%  [RES - 0603]
R61  330R/1%  [RES - 0603]
SD1  SD Card  [MICRO SD CARD]
U13  AT24C256C  [SOIC-8]
U14  DS3231SN#  [SOIC -16]

### Ports
3V3_SCL (in, see MCU[5A]), 3V3_SDA (bidir, see MCU[5A]), SD_CD (out, see MCU[5B]), SD_CLK (in, see MCU[7A]), SD_CS (in, see MCU[7B]), SD_MISO (out, see MCU[5B]), SD_MOSI (in, see MCU[7A])

### Nets
+3.3V: C9.2 C35.2 C36.2 C37.2 C38.2 C63.2 C64.2 R30.2 R36.1 R37.1 R40.1 R41.1 R51.2 R61.1 SD1.4(VDD) U13.8(VCC) U14.2(VCC)
GND: C9.1 C35.1 C36.1 C37.1 C38.1 C63.1 C64.1 LED12.2 SD1.6(VSS) SD1.G1(COVER_GND) SD1.G2(COVER_GND) SD1.G3(COVER_GND) SD1.G4(COVER_GND) U13.1(A0) U13.2(A1) U13.3(A2) U13.4(GND) U13.7(WP) U14.13(GND)
VBAT: U14.14(VBAT)
3V3_SCL: R30.1 U13.6(SCL) U14.16(SCL) ; port 3V3_SCL
3V3_SDA: R51.1 U13.5(SDA) U14.15(SDA) ; port 3V3_SDA
SD_CD: SD1.CD ; port SD_CD
SD_CS: R36.2 R46.2 ; port SD_CS
SD_MISO: R37.2 R45.2 ; port SD_MISO
SD_MOSI: R40.2 R43.2 ; port SD_MOSI
NetLED12_1: LED12.1 R61.2
NetR41_2: R41.2 R42.2 ; port SD_CLK
NetR42_1: R42.1 SD1.5(CLK)
NetR43_1: R43.1 SD1.3(CMD)
NetR45_1: R45.1 SD1.7(DAT0)
NetR46_1: R46.1 SD1.2(CD/DAT3)

Not connected (* = marked no-connect by the designer): MH1 1(76)*; MH2 1(76)*; MH3 1(76)*; MH4 1(76)*; SD1 1(DAT2)* 8(DAT1)*; U14 1(32KHZ)* 3(SQW/~{INT})* 4(~{RST})*

### Notes on the sheet
- POWER FILTERs  &  POWER LED
- EEPROM MEMORY
- REAL TIME CLOCK (RTC)
- MICRO SD CARD
- MOUNTING HOLEs

### Library data of the parts
C9 C35-C38 C63 C64 = CAPACITOR: CAPACITOR SMD - KEMET
LED12 = LED_SMD: LED SMD
R30 R36 R37 R40-R43 R45 R46 R51 R61 = RESISTOR: Resistor SMD - YAGEO
SD1 = SD Card: Micro SD Card Connector, 9 Positions, Connector and Ejector, Push In, Auto Eject Out, Surface Mount, 0.95 mm Height Above Board, Gold Flash
U13 = AT24C256C: EEPROM Memory IC 256Kb (32K x 8), I2C Protocol
U14 = DS3231SN#: Extremely Accurate I²C-Integrated RTC/TCXO/Crystal

## Sheet MCU.SchDoc
size A3; SheetNumber: 9; SheetTotal: 9
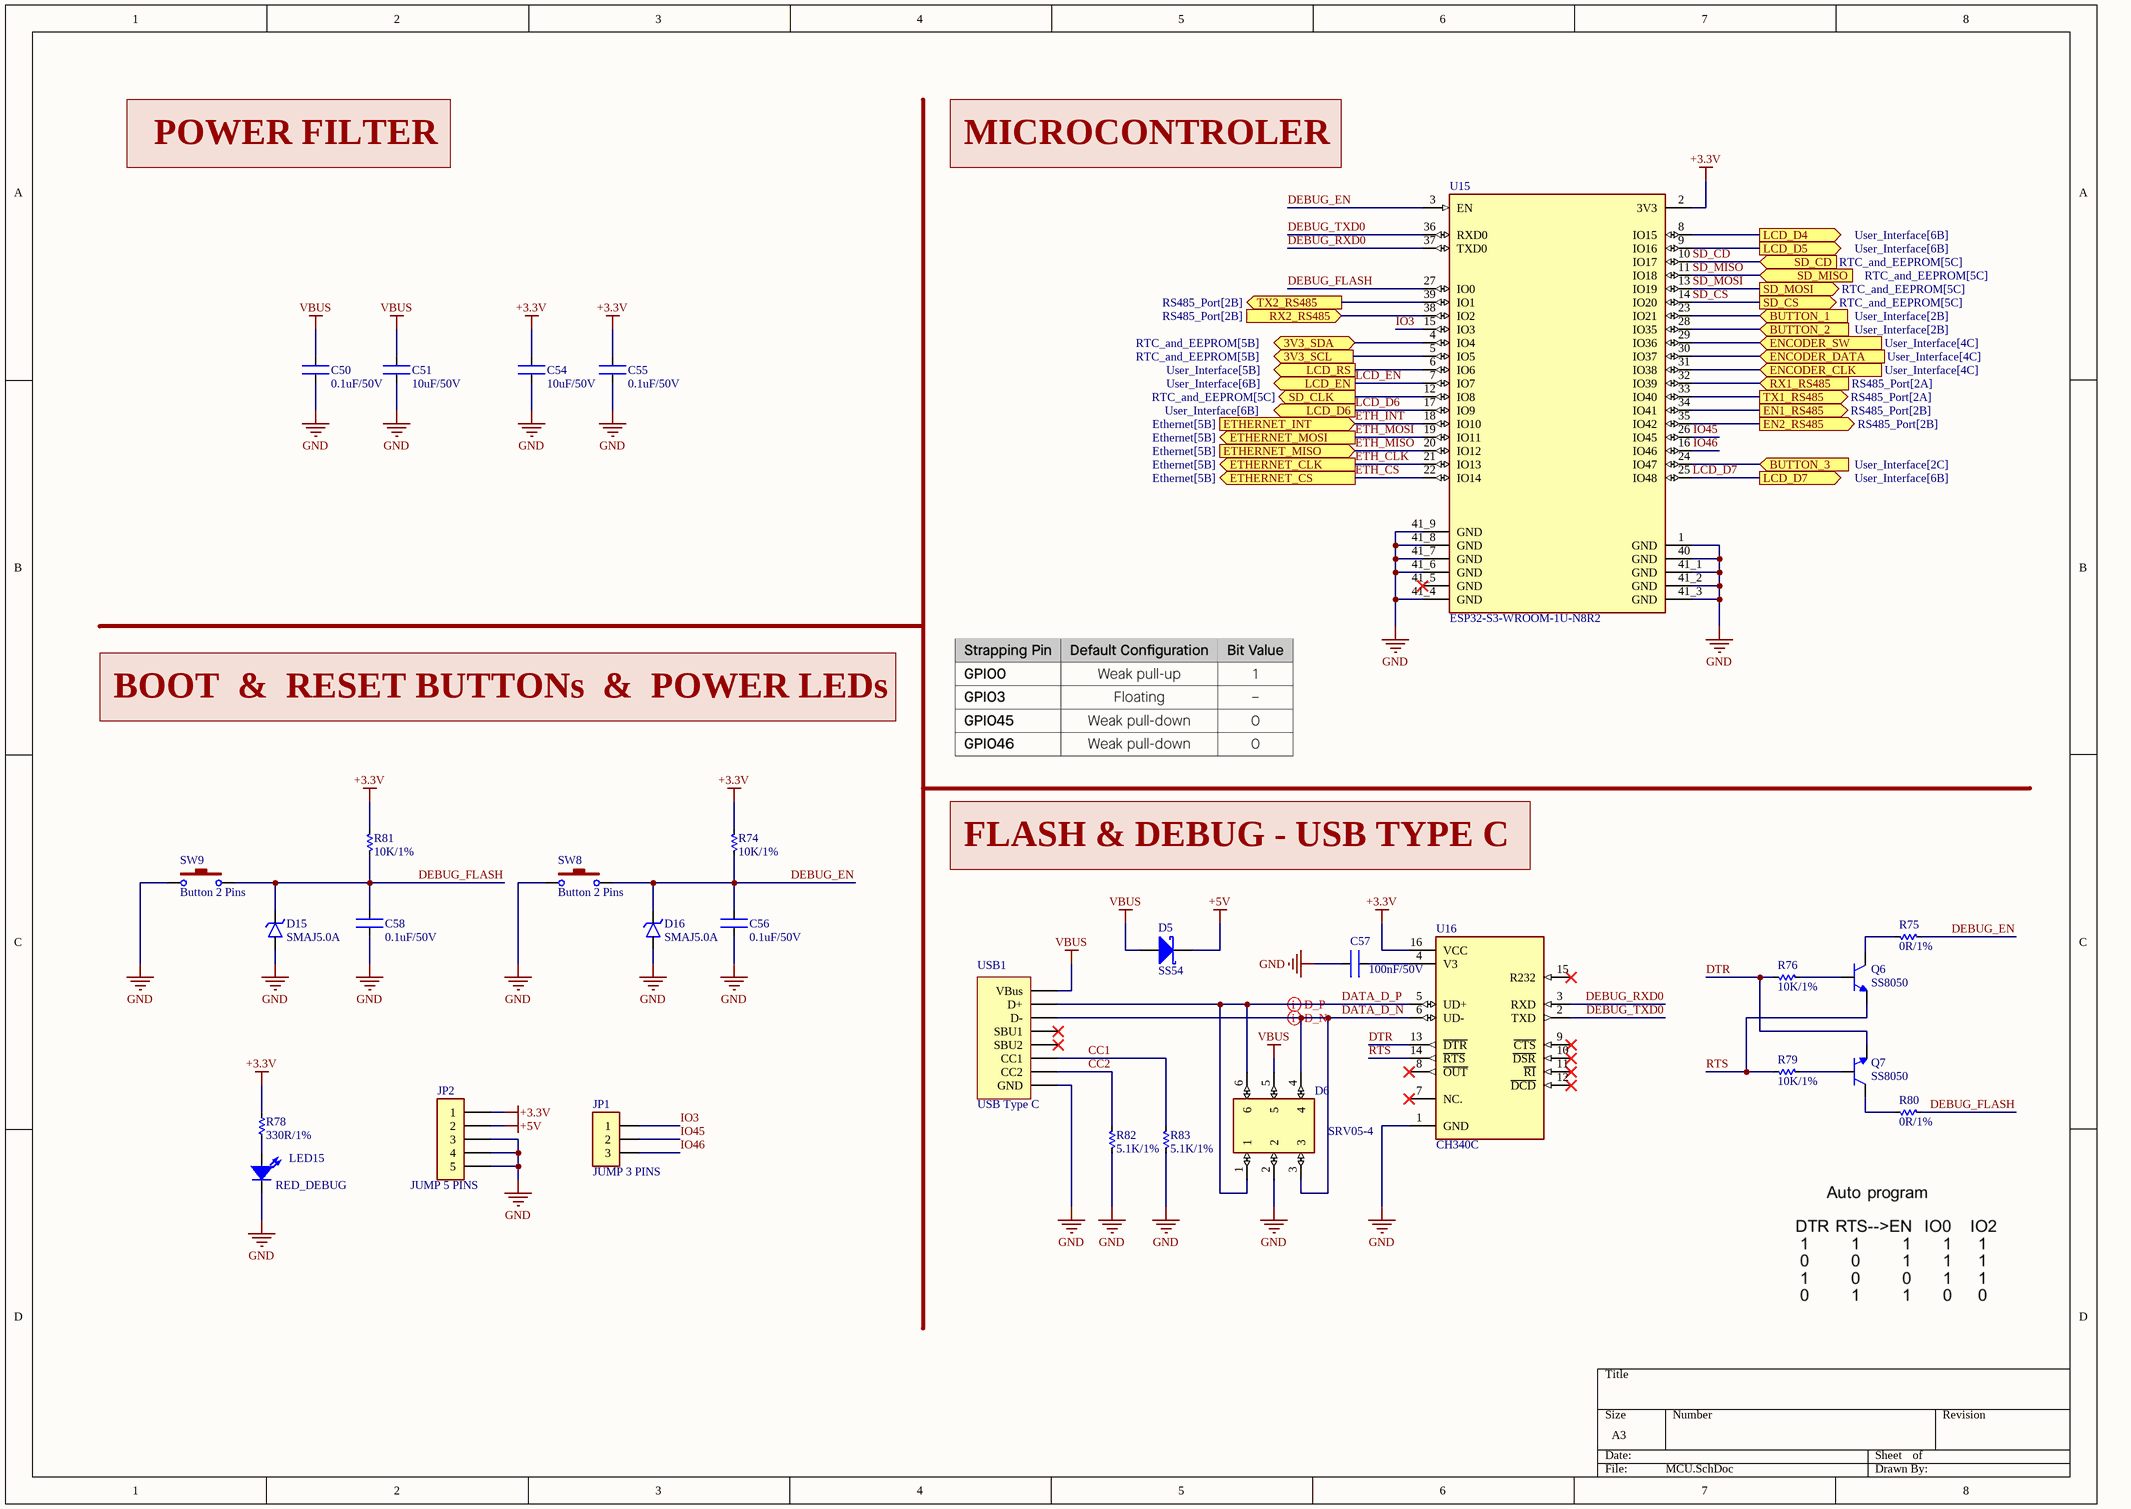
[diagram p6: MCU.SchDoc]

### Parts
C50  0.1uF/50V  [CAP - 0603]
C51  10uF/50V  [CAP - 0603]
C54  10uF/50V  [CAP - 0603]
C55  0.1uF/50V  [CAP - 0603]
C56  0.1uF/50V  [CAP - 0603]
C57  100nF/50V  [CAP - 0603]
C58  0.1uF/50V  [CAP - 0603]
D5  SS54  [SS54]
D6  SRV05-4  [SOT-23-6]
D15  SMAJ5.0A  [DO-214AC]
D16  SMAJ5.0A  [DO-214AC]
JP1  JUMP 3 PINS  [JUMP 3 PINS]
JP2  JUMP 5 PINS  [JUMP 5 PINS]
LED15  RED_DEBUG  [RED_LED_0603]
Q6  SS8050  [SOT23-3]
Q7  SS8050  [SOT23-3]
R74  10K/1%  [RES - 0603]
R75  0R/1%  [RES - 0603]
R76  10K/1%  [RES - 0603]
R78  330R/1%  [RES - 0603]
R79  10K/1%  [RES - 0603]
R80  0R/1%  [RES - 0603]
R81  10K/1%  [RES - 0603]
R82  5.1K/1%  [RES - 0603]
R83  5.1K/1%  [RES - 0603]
SW8  Button 2 Pins  [SW-DIP-6x6mm]
SW9  Button 2 Pins  [SMD SWITCH 2 PINS]
U15  ESP32-S3-WROOM-1U-N8R2  [ESP32-S3-WROOM-1U-N8R2]
U16  CH340C  [SOIC127P600X180-16N]
USB1  USB Type C  [Type-C-16Pins]

### Ports
3V3_SCL (out, see RTC_and_EEPROM[5B]), 3V3_SDA (bidir, see RTC_and_EEPROM[5B]), BUTTON_1 (in, see User_Interface[2B]), BUTTON_2 (in, see User_Interface[2B]), BUTTON_3 (in, see User_Interface[2C]), EN1_RS485 (out, see RS485_Port[2B]), EN2_RS485 (out, see RS485_Port[2B]), ENCODER_CLK (in, see User_Interface[4C]), ENCODER_DATA (in, see User_Interface[4C]), ENCODER_SW (in, see User_Interface[4C]), ETHERNET_CLK (out, see Ethernet[5B]), ETHERNET_CS (out, see Ethernet[5B]), ETHERNET_INT (in, see Ethernet[5B]), ETHERNET_MISO (in, see Ethernet[5B]), ETHERNET_MOSI (out, see Ethernet[5B]), LCD_D4 (out, see User_Interface[6B]), LCD_D5 (out, see User_Interface[6B]), LCD_D6 (out, see User_Interface[6B]), LCD_D7 (out, see User_Interface[6B]), LCD_EN (out, see User_Interface[6B]), LCD_RS (out, see User_Interface[5B]), RX1_RS485 (in, see RS485_Port[2A]), RX2_RS485 (in, see RS485_Port[2B]), SD_CD (in, see RTC_and_EEPROM[5C]), SD_CLK (out, see RTC_and_EEPROM[5C]), SD_CS (out, see RTC_and_EEPROM[5C]), SD_MISO (in, see RTC_and_EEPROM[5C]), SD_MOSI (out, see RTC_and_EEPROM[5C]), TX1_RS485 (out, see RS485_Port[2A]), TX2_RS485 (out, see RS485_Port[2B])

### Nets
+3.3V: C54.2 C55.2 JP2.01(1) R74.2 R78.1 R81.1 U15.2(3V3) U16.16(VCC)
+5V: D5.2(K) JP2.02(2)
GND: C50.1 C51.1 C54.1 C55.1 C56.1 C57.1 C58.1 D6.2 D15.A D16.A JP2.03(3) JP2.04(4) JP2.05(5) LED15.2 R82.2 R83.2 SW8.1 SW9.1 U15.1(GND) U15.40(GND) U15.41_1(GND) U15.41_2(GND) U15.41_3(GND) U15.41_4(GND) U15.41_6(GND) U15.41_7(GND) U15.41_8(GND) U15.41_9(GND) U16.1(GND) USB1.A1,B1,SHIELD(GND)
VBUS: C50.2 C51.2 D5.1(A) D6.5 USB1.A4,B4(VBus)
3V3_SCL: U15.5(IO5) ; port 3V3_SCL
3V3_SDA: U15.4(IO4) ; port 3V3_SDA
CC1: R83.1 USB1.A5(CC1)
CC2: R82.1 USB1.B5(CC2)
DATA_D_N: D6.3 D6.4 U16.6(UD-) USB1.A7,B7(D-)
DATA_D_P: D6.1 D6.6 U16.5(UD+) USB1.A6,B6(D+)
DEBUG_EN: C56.2 D16.C R74.1 R75.1 SW8.2 U15.3(EN)
DEBUG_FLASH: C58.2 D15.C R80.1 R81.2 SW9.2 U15.27(IO0)
DEBUG_RXD0: U15.37(TXD0) U16.3(RXD)
DEBUG_TXD0: U15.36(RXD0) U16.2(TXD)
DTR: Q7.2(E) R76.1 U16.13(~{DTR})
EN1_RS485: U15.34(IO41) ; port EN1_RS485
EN2_RS485: U15.35(IO42) ; port EN2_RS485
ENC_CLK: U15.31(IO38) ; port ENCODER_CLK
ENC_DATA: U15.30(IO37) ; port ENCODER_DATA
ENC_SW: U15.29(IO36) ; port ENCODER_SW
ETH_CLK: U15.21(IO13) ; port ETHERNET_CLK
ETH_CS: U15.22(IO14) ; port ETHERNET_CS
ETH_INT: U15.18(IO10) ; port ETHERNET_INT
ETH_MISO: U15.20(IO12) ; port ETHERNET_MISO
ETH_MOSI: U15.19(IO11) ; port ETHERNET_MOSI
IO3: JP1.01(1) U15.15(IO3)
IO45: JP1.02(2) U15.26(IO45)
IO46: JP1.03(3) U15.16(IO46)
LCD_D6: U15.17(IO9) ; port LCD_D6
LCD_D7: U15.25(IO48) ; port LCD_D7
LCD_EN: U15.7(IO7) ; port LCD_EN
RTS: Q6.2(E) R79.1 U16.14(~{RTS})
RX1_RS485: U15.32(IO39) ; port RX1_RS485
RX2_RS485: U15.38(IO2) ; port RX2_RS485
SD_CD: U15.10(IO17) ; port SD_CD
SD_CS: U15.14(IO20) ; port SD_CS
SD_MISO: U15.11(IO18) ; port SD_MISO
SD_MOSI: U15.13(IO19) ; port SD_MOSI
TX1_RS485: U15.33(IO40) ; port TX1_RS485
TX2_RS485: U15.39(IO1) ; port TX2_RS485
NetC44_2: U15.23(IO21) ; port BUTTON_1
NetC45_2: U15.28(IO35) ; port BUTTON_2
NetC49_2: U15.24(IO47) ; port BUTTON_3
NetC57_2: C57.2 U16.4(V3)
NetLCD1_4: U15.6(IO6) ; port LCD_RS
NetLCD1_11: U15.8(IO15) ; port LCD_D4
NetLCD1_12: U15.9(IO16) ; port LCD_D5
NetLED15_1: LED15.1 R78.2
NetQ6_1: Q6.1(B) R76.2
NetQ6_3: Q6.3(C) R75.2
NetQ7_1: Q7.1(B) R79.2
NetQ7_3: Q7.3(C) R80.2
NetR41_2: U15.12(IO8) ; port SD_CLK

Not connected (* = marked no-connect by the designer): U15 41_5(GND)*; U16 7(NC.)* 8(~{OUT})* 9(~{CTS})* 10(~{DSR})* 11(~{RI})* 12(~{DCD})* 15(R232)*; USB1 A8(SBU1)* B8(SBU2)*

### Layout directives
differential pair: DATA_D_N, DATA_D_P

### Notes on the sheet
- POWER FILTER
- MICROCONTROLER
- BOOT  &  RESET BUTTONs  &  POWER LEDs
- FLASH & DEBUG - USB TYPE C

### Library data of the parts
C50 C51 C54-C58 = CAPACITOR: CAPACITOR SMD - KEMET
D5 = SS54: DIODE SCHOTTKY 40V 5A SMA; Supplier 1: Newark; Supplier Part Number 1: 08X3002
D6 = SRV05-4: 17.5V Clamp 12A (8/20µs) Ipp Tvs Diode Surface Mount SOT-23-6
D15 D16 = SMAJ5.0A: TVS, 400W, 5V, Unidirectional
JP1 = JUMP 3 PINS: JUMP 3 PINS DIP; Supplier 1: Avnet; Supplier Part Number 1: TS-103-G-A
JP2 = JUMP 5 PINS: JUMP 5 PINS DIP; Supplier 1: Avnet; Supplier Part Number 1: TSW-105-23-L-S-LL
LED15 = LED_SMD: LED SMD
Q6 Q7 = SS8050: Bipolar (BJT) Transistor NPN 25 V 1.5 A 100MHz 300 mW Surface Mount SOT-23-3
R74-R76 R78-R83 = RESISTOR: Resistor SMD - YAGEO
SW8 SW9 = Button 2 Pins: SMD Button; Supplier 1: Newark; Supplier Part Number 1: 35AH5160
U15 = ESP32-S3-WROOM-1U-N8R2: Bluetooth, WiFi 802.11b/g/n, Bluetooth v5.0 Transceiver Module 2.4GHz Antenna Not Included, U.FL Surface Mount
U16 = CH340C: USB to serial chip CH340
USB1 = USB Type C: Type 16 Pins (Include 4 GND Pins)

## Nets that join several sheets
+3.3V: Power_Supply (7 pins), Ethernet (13 pins), RS485_Port (6 pins), User_Interface (6 pins), RTC_and_EEPROM (17 pins), MCU (8 pins)
+5V: Power_Supply (11 pins), User_Interface (5 pins), MCU (D5.2 JP2.02)
+5V_RS485: Power_Supply (C14.1 U3.4), RS485_Port (18 pins)
GND: Power_Supply (32 pins), Ethernet (32 pins), RS485_Port (6 pins), User_Interface (23 pins), RTC_and_EEPROM (19 pins), MCU (30 pins)
GND_RS485: Power_Supply (C14.2 TP3.1 U3.3), RS485_Port (18 pins)
VBAT: Power_Supply (VBAT1.P), RTC_and_EEPROM (U14.14)
3V3_SCL: RTC_and_EEPROM (R30.1 U13.6 U14.16), MCU (U15.5)
3V3_SDA: RTC_and_EEPROM (R51.1 U13.5 U14.15), MCU (U15.4)
EN1_RS485: RS485_Port (U7.2), MCU (U15.34)
EN2_RS485: RS485_Port (U7.3), MCU (U15.35)
ENC_CLK: User_Interface (C47.2 D13.C EN1.A R69.1), MCU (U15.31)
ENC_DATA: User_Interface (C48.2 D12.C EN1.B R70.1), MCU (U15.30)
ENC_SW: User_Interface (C46.2 D11.C EN1.E R68.1), MCU (U15.29)
ETH_CLK: Ethernet (R14.2), MCU (U15.21)
ETH_CS: Ethernet (R10.1 U4.32), MCU (U15.22)
ETH_INT: Ethernet (R11.1 U4.36), MCU (U15.18)
ETH_MISO: Ethernet (R13.2), MCU (U15.20)
ETH_MOSI: Ethernet (R12.2), MCU (U15.19)
LCD_D6: User_Interface (LCD1.13), MCU (U15.17)
LCD_D7: User_Interface (LCD1.14), MCU (U15.25)
LCD_EN: User_Interface (LCD1.6), MCU (U15.7)
NetC44_2: User_Interface (C44.2 D9.C R65.1 SW5.2), MCU (U15.23)
NetC45_2: User_Interface (C45.2 D10.C R66.1 SW6.2), MCU (U15.28)
NetC49_2: User_Interface (C49.2 D14.C R72.2 SW7.2), MCU (U15.24)
NetLCD1_4: User_Interface (LCD1.4), MCU (U15.6)
NetLCD1_11: User_Interface (LCD1.11), MCU (U15.8)
NetLCD1_12: User_Interface (LCD1.12), MCU (U15.9)
NetR41_2: RTC_and_EEPROM (R41.2 R42.2), MCU (U15.12)
RX1_RS485: RS485_Port (U6.2), MCU (U15.32)
RX2_RS485: RS485_Port (U8.2), MCU (U15.38)
SD_CD: RTC_and_EEPROM (SD1.CD), MCU (U15.10)
SD_CS: RTC_and_EEPROM (R36.2 R46.2), MCU (U15.14)
SD_MISO: RTC_and_EEPROM (R37.2 R45.2), MCU (U15.11)
SD_MOSI: RTC_and_EEPROM (R40.2 R43.2), MCU (U15.13)
TX1_RS485: RS485_Port (U6.3), MCU (U15.33)
TX2_RS485: RS485_Port (U8.3), MCU (U15.39)